# Altium project TC264驱动.PrjPcb
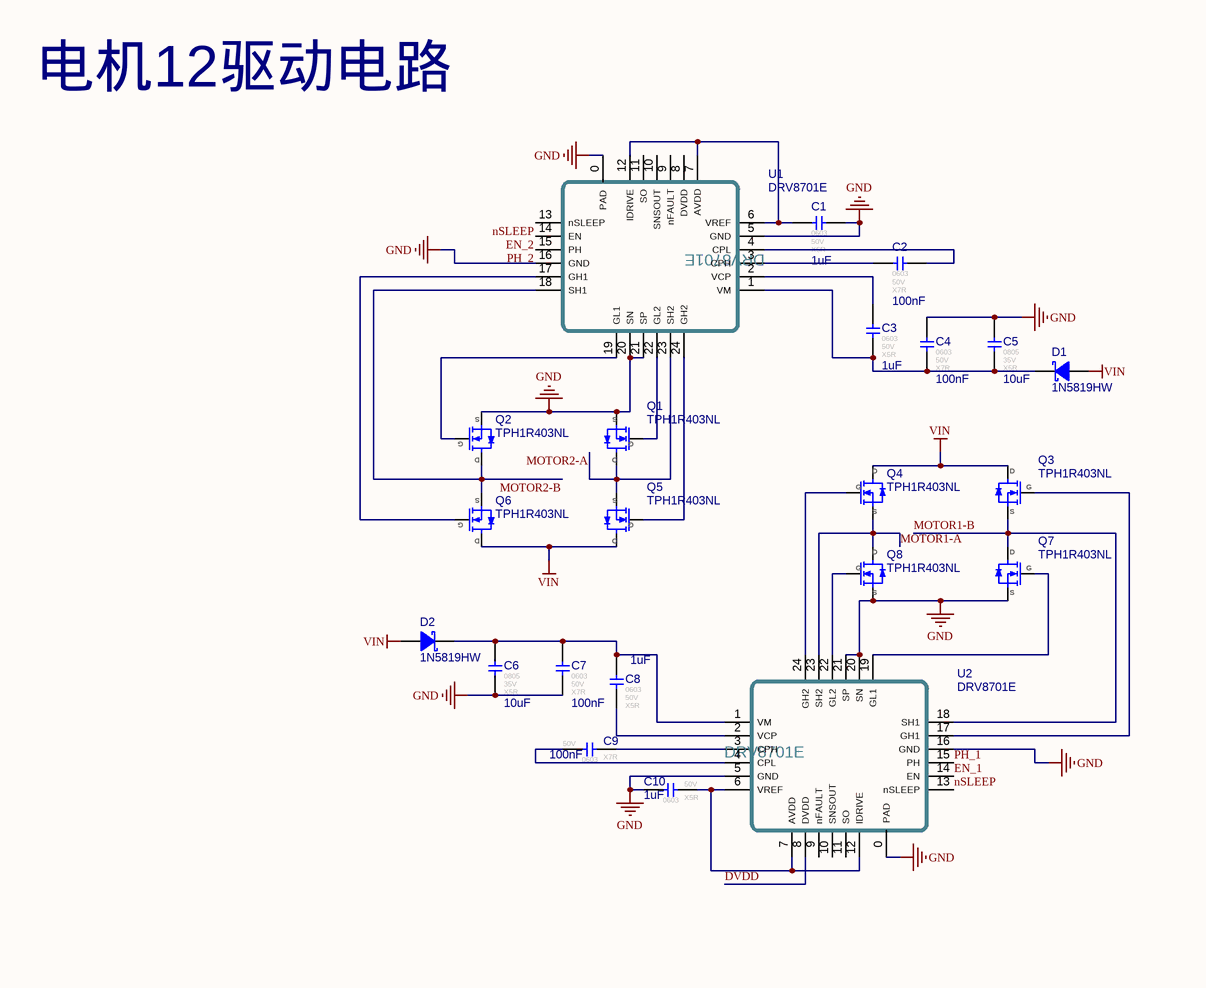
[diagram p0: TC264Driver.SchDoc, top left]
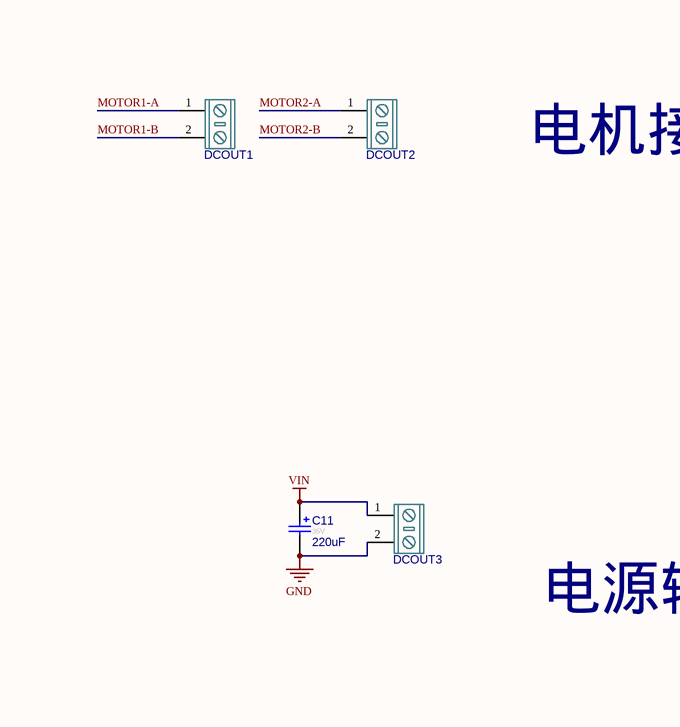
[diagram p1: TC264Driver.SchDoc, top right]
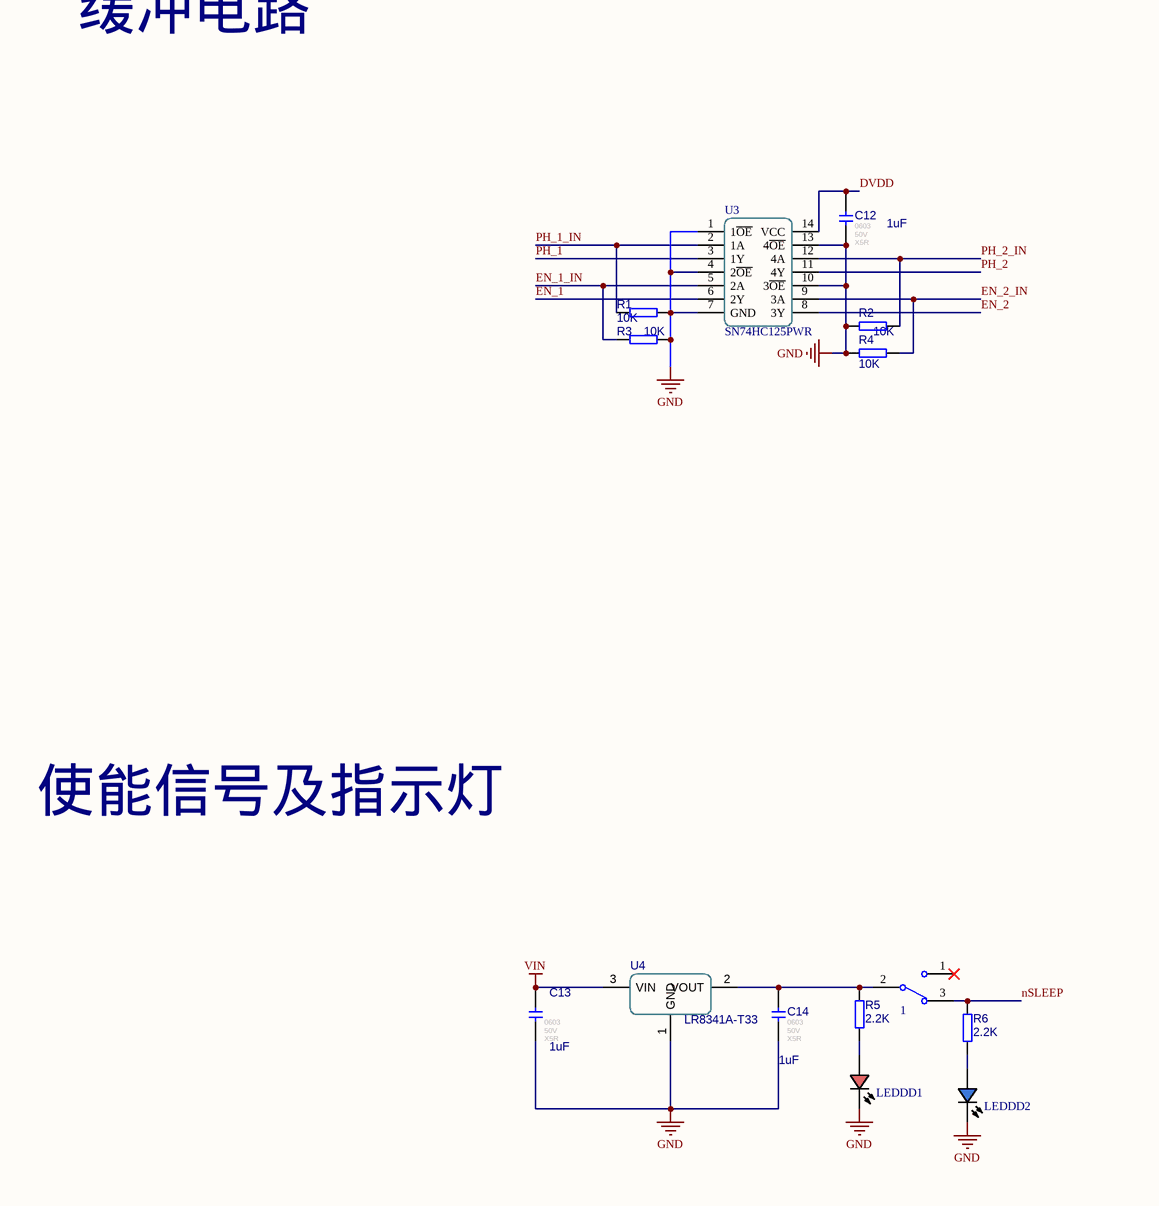
[diagram p2: TC264Driver.SchDoc, bottom left]
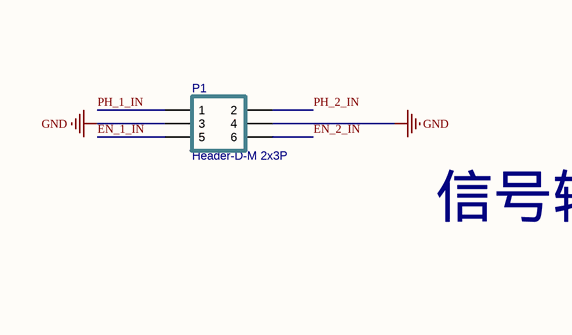
[diagram p3: TC264Driver.SchDoc, bottom right]
1 sheet, 41 parts. Net scope: global (net labels, ports and power ports of the same name join across sheets).
Board file: TC264Driver.PcbDoc

## Sheet TC264Driver.SchDoc
size A1; SheetNumber: 1; SheetTotal: 1

### Parts
1  SW-SPDT  [SS12D10]  (value not drawn)
C1  value 1uF  FootPrint: 0603  Voltage: 50V  Type: X5R  [CAPC1608[0603]S-L]  (hidden comment: 1uF 50V X5R)
C2  value 100nF  FootPrint: 0603  Voltage: 50V  Type: X7R  [CAPC1608[0603]S-L]  (hidden comment: 100nF 50V X7R)
C3  value 1uF  FootPrint: 0603  Voltage: 50V  Type: X5R  [CAPC1608[0603]S-L]  (hidden comment: 1uF 50V X5R)
C4  value 100nF  FootPrint: 0603  Voltage: 50V  Type: X7R  [CAPC1608[0603]S-L]  (hidden comment: 100nF 50V X7R)
C5  value 10uF  FootPrint: 0805  Voltage: 35V  Type: X5R  [CAPC2012[0805]S-L]  (hidden comment: 10uF 35V X5R)
C6  value 10uF  FootPrint: 0805  Voltage: 35V  Type: X5R  [CAPC2012[0805]S-L]  (hidden comment: 10uF 35V X5R)
C7  value 100nF  FootPrint: 0603  Voltage: 50V  Type: X7R  [CAPC1608[0603]S-L]  (hidden comment: 100nF 50V X7R)
C8  value 1uF  FootPrint: 0603  Voltage: 50V  Type: X5R  [CAPC1608[0603]S-L]  (hidden comment: 1uF 50V X5R)
C9  value 100nF  FootPrint: 0603  Voltage: 50V  Type: X7R  [CAPC1608[0603]S-L]  (hidden comment: 100nF 50V X7R)
C10  value 1uF  FootPrint: 0603  Voltage: 50V  Type: X5R  [CAPC1608[0603]S-L]  (hidden comment: 1uF 50V X5R)
C11  value 220uF  Voltage: 35V  [Cap-S-D 3.5-8x11.5]  (hidden comment: 220uF 35V 聚合物固态)
C12  value 1uF  FootPrint: 0603  Voltage: 50V  Type: X5R  [CAPC1608[0603]S-L]  (hidden comment: 1uF 50V X5R)
C13  value 1uF  FootPrint: 0603  Voltage: 50V  Type: X5R  [CAPC1608[0603]S-L]  (hidden comment: 1uF 50V X5R)
C14  value 1uF  FootPrint: 0603  Voltage: 50V  Type: X5R  [CAPC1608[0603]S-L]  (hidden comment: 1uF 50V X5R)
D1  1N5819HW  [SOD-123-L]
D2  1N5819HW  [SOD-123-L]
DCOUT1  KF/WJ/DG 30x connecter  [KF/WJ/DG 301-2p-5.0mm]  (value not drawn)
DCOUT2  KF/WJ/DG 30x connecter  [KF/WJ/DG 301-2p-5.0mm]  (value not drawn)
DCOUT3  KF/WJ/DG 30x connecter  [KF/WJ/DG 301-2p-5.0mm]  (value not drawn)
LEDDD1  红色贴片LED  [LEDC1608(0603)-L]  (value not drawn)
LEDDD2  蓝色贴片LED  [LEDC1608(0603)-L]  (value not drawn)
P1  Header-D-M 2x3P  [HDR2X3-M]
Q1  TPH1R403NL  [DFN5x6]
Q2  TPH1R403NL  [DFN5x6]
Q3  TPH1R403NL  [DFN5x6]
Q4  TPH1R403NL  [DFN5x6]
Q5  TPH1R403NL  [DFN5x6]
Q6  TPH1R403NL  [DFN5x6]
Q7  TPH1R403NL  [DFN5x6]
Q8  TPH1R403NL  [DFN5x6]
R1  value 10K  [RESC1608[0603]S-L]  (hidden comment: 10K ±1%)
R2  value 10K  [RESC1608[0603]S-L]  (hidden comment: 10K ±1%)
R3  value 10K  [RESC1608[0603]S-L]  (hidden comment: 10K ±1%)
R4  value 10K  [RESC1608[0603]S-L]  (hidden comment: 10K ±1%)
R5  value 2.2K  [RESC1608[0603]S-L]  (hidden comment: 2.2K ±1%)
R6  value 2.2K  [RESC1608[0603]S-L]  (hidden comment: 2.2K ±1%)
U1  DRV8701E  [QFN24-4x4]
U2  DRV8701E  [QFN24-4x4]
U3  SN74HC125PWR  [TSSOP-14]
U4  LR8341A-T33  [SOT-23]

### Nets
GND: C1.2 C4.1 C5.1 C6.1 C7.1 C10.2 C11.2 C12.2 C13.2 C14.2 DCOUT3.2 LEDDD1.C LEDDD2.C P1.3 P1.4 Q1.3(S) Q2.3(S) Q7.3(S) Q8.3(S) R1.2 R2.2 R3.2 R4.2 U1.0(PAD) U1.5(GND) U1.16(GND) U1.20(SN) U1.21(SP) U2.0(PAD) U2.5(GND) U2.16(GND) U2.20(SN) U2.21(SP) U3.1(1~{OE}) U3.4(2~{OE}) U3.7(GND) U3.10(3~{OE}) U3.13(4~{OE}) U4.1(GND)
VIN: C11.1 C13.1 D1.A D2.A DCOUT3.1 Q3.1(D) Q4.1(D) Q5.1(D) Q6.1(D) U4.3(VIN)
DVDD: C12.1 U2.8(DVDD) U3.14(VCC)
EN_1: U2.14(EN) U3.6(2Y)
EN_1_IN: P1.5 R3.1 U3.5(2A)
EN_2: U1.14(EN) U3.8(3Y)
EN_2_IN: P1.6 R4.1 U3.9(3A)
MOTOR1-A: DCOUT1.1 Q4.3(S) Q8.1(D) U2.23(SH2)
MOTOR1-B: DCOUT1.2 Q3.3(S) Q7.1(D) U2.18(SH1)
MOTOR2-A: DCOUT2.1 Q1.1(D) Q5.3(S) U1.23(SH2)
MOTOR2-B: DCOUT2.2 Q2.1(D) Q6.3(S) U1.18(SH1)
nSLEEP: 1.3 R6.2 U1.13(nSLEEP) U2.13(nSLEEP)
PH_1: U2.15(PH) U3.3(1Y)
PH_1_IN: P1.1 R1.1 U3.2(1A)
PH_2: U1.15(PH) U3.11(4Y)
PH_2_IN: P1.2 R2.1 U3.12(4A)
Net1_2: 1.2 C14.1 R5.2 U4.2(VOUT)
NetC1_1: C1.1 U1.6(VREF) U1.7(AVDD) U1.12(IDRIVE)
NetC2_1: C2.1 U1.3(CPH)
NetC2_2: C2.2 U1.4(CPL)
NetC3_1: C3.1 U1.2(VCP)
NetC3_2: C3.2 C4.2 C5.2 D1.K U1.1(VM)
NetC6_2: C6.2 C7.2 C8.2 D2.K U2.1(VM)
NetC8_1: C8.1 U2.2(VCP)
NetC9_1: C9.1 U2.3(CPH)
NetC9_2: C9.2 U2.4(CPL)
NetC10_1: C10.1 U2.6(VREF) U2.7(AVDD) U2.12(IDRIVE)
NetLEDDD1_A: LEDDD1.A R5.1
NetLEDDD2_A: LEDDD2.A R6.1
NetQ1_2: Q1.2(G) U1.22(GL2)
NetQ2_2: Q2.2(G) U1.19(GL1)
NetQ3_2: Q3.2(G) U2.17(GH1)
NetQ4_2: Q4.2(G) U2.24(GH2)
NetQ5_2: Q5.2(G) U1.24(GH2)
NetQ6_2: Q6.2(G) U1.17(GH1)
NetQ7_2: Q7.2(G) U2.19(GL1)
NetQ8_2: Q8.2(G) U2.22(GL2)

Not connected (* = marked no-connect by the designer): 1 1*; U1 8(DVDD) 9(nFAULT) 10(SNSOUT) 11(SO); U2 9(nFAULT) 10(SNSOUT) 11(SO)

### Notes on the sheet
- 电机12驱动电路
- 电机接口
- 电源输入端子
- 缓冲电路
- 信号输入接口
- 使能信号及指示灯

### Library data of the parts
1 = SW-SPDT_1: 单刀双掷开关 3脚船型、钮子、拨动开关 SPDT Subminiature Toggle Switch; Published: 24-Mar-1999; Publisher: Altium Limited; Price(RMB): 0.000
C1 C3 C8 C10 C12-C14 = 1uF 0603 50V X5R: 贴片瓷片电容; MLCC; 0603(1608);; Revision: V1.0
C2 C4 C7 C9 = 100nF 0603 50V X7R: 贴片瓷片电容; MLCC; 0603(1608);; Revision: V1.0
C5 C6 = 10uF 0805 35V X5R: 贴片瓷片电容; MLCC; 0805(2012);; Revision: V1.0
C11 = S-D 220uF 35V 8x12: 直插固态电容 220uF 35V 8x12; Revision: V1.0; Type: 聚合物固态
D1 D2 = 1N5819HW: 1N5819HW 肖特基二极管; Revision: V1.0; Value: 1N5819HW
DCOUT1-DCOUT3 = KF/WJ/DG 30x: 接线端子 2Pin
LEDDD1 = LED Chip Red: Published: 8-Jun-2000; Revision: July-2002: Re-released for DXP Platform.; Publisher: Altium Limited; Price(RMB): 0.00
LEDDD2 = LED Chip Blue: Published: 8-Jun-2000; Revision: July-2002: Re-released for DXP Platform.; Publisher: Altium Limited; Price(RMB): 0.00; Color: Blue
P1 = Header-D-M 2x3P: 2x3pin, 直插, 双排针; Revision: V1.0; Value: Header-D-M 2x3P
Q1-Q8 = TPH1R403NL: 东芝 N沟 MOS
R1-R4 = Res-Chip_12: 贴片电阻; Revision: V1.0; Tolerance: ±1%
R5 R6 = Res-Chip_1_1: 贴片电阻; Revision: V1.0; Tolerance: ±1%
U1 U2 = DRV8701E: DRV8701E Ti全桥驱动芯片
U3 = SN74HC125PWR: 三态输出的四路缓冲器 TSSOP-20
U4 = LR8341A-T33: LDO Vin:40V  Vout:3.3V 100mA ±1% 55dB; Revision: V1.0; Value: LR8341A-T33